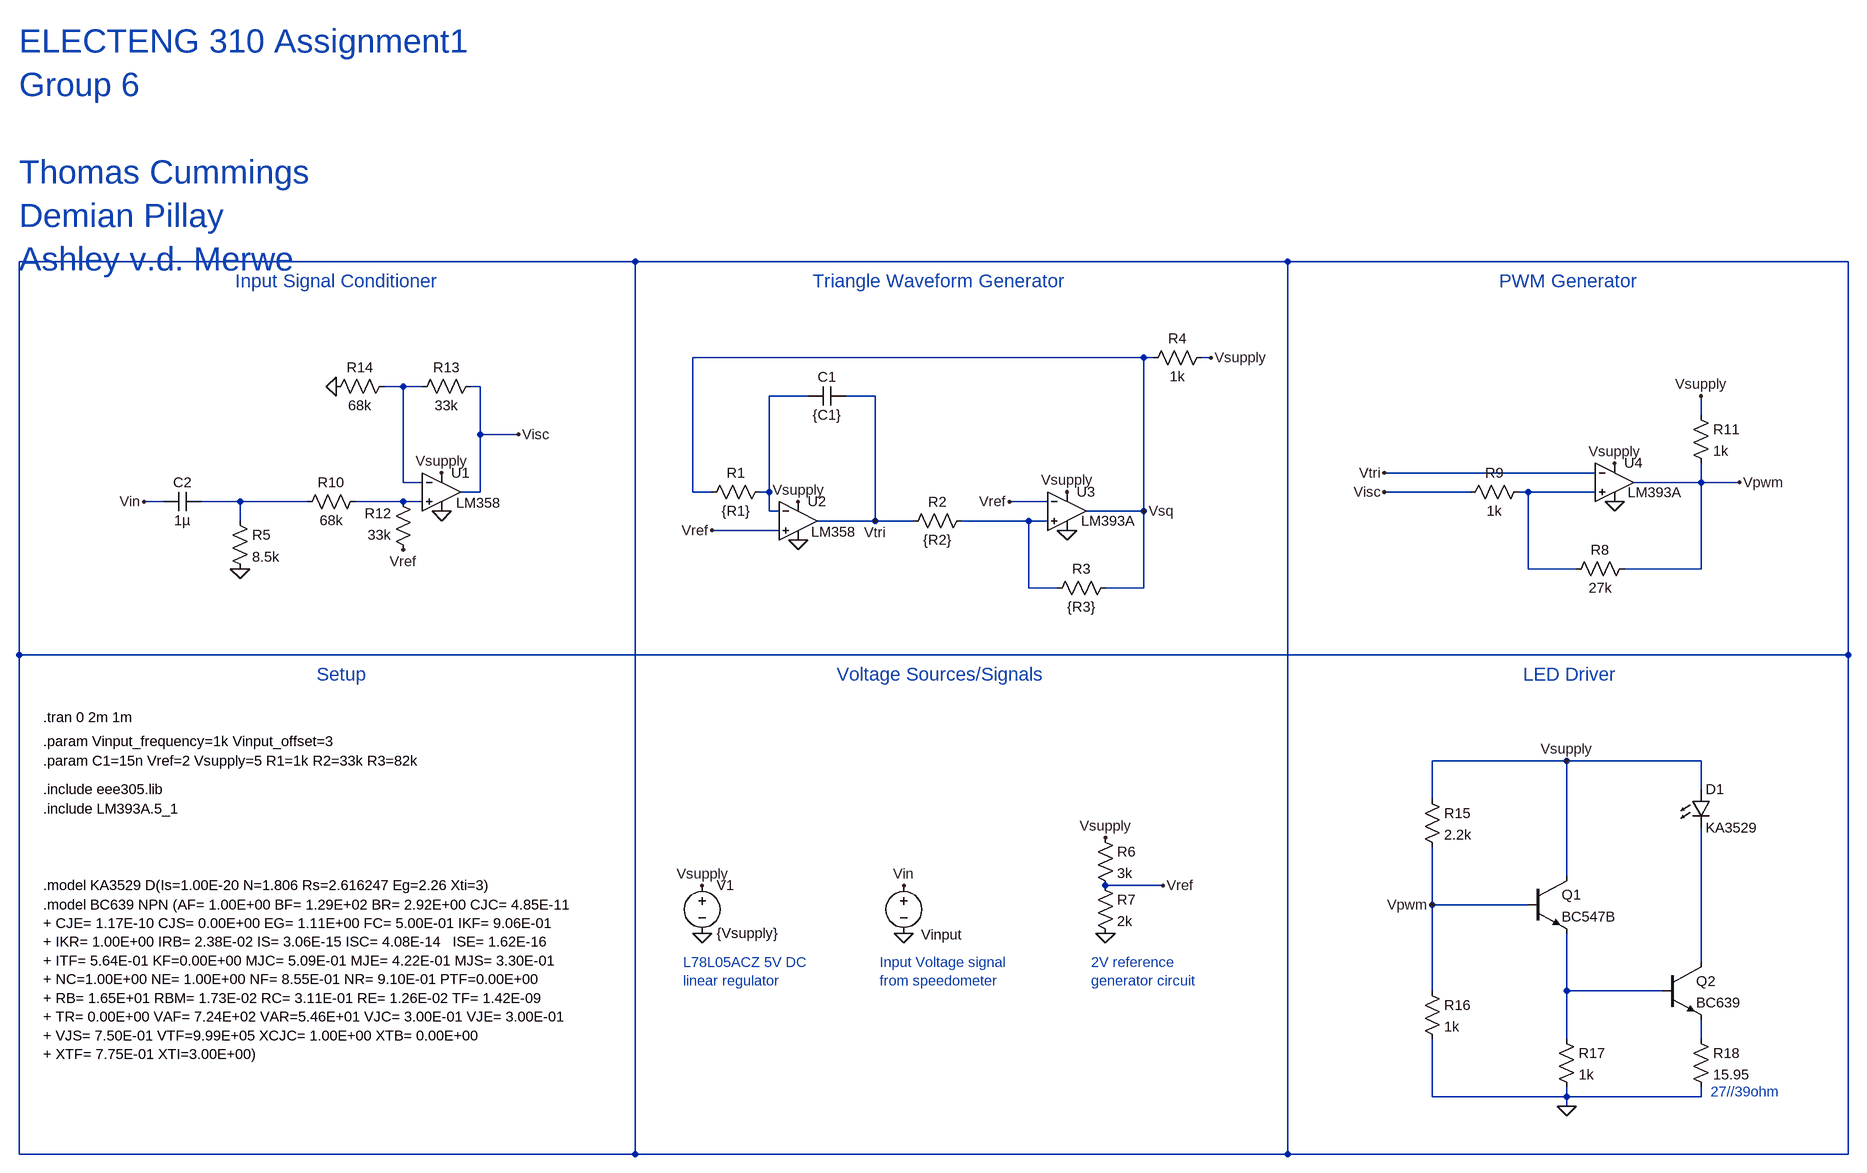
[diagram p0: schematic Assignment1_Task2_2_Practical.asc]
Assignment1_Task2_2_Practical.asc, the LTspice schematic file:
Version 4
SHEET 1 6052 1384
WIRE -336 -400 -1424 -400
WIRE 752 -400 -336 -400
WIRE 1856 -400 752 -400
WIRE 512 -240 -240 -240
WIRE 528 -240 512 -240
WIRE 624 -240 608 -240
WIRE -784 -192 -816 -192
WIRE -752 -192 -784 -192
WIRE -656 -192 -672 -192
WIRE -48 -176 -112 -176
WIRE 64 -176 16 -176
WIRE 1504 -144 1504 -176
WIRE -656 -112 -656 -192
WIRE -592 -112 -656 -112
WIRE 1328 -48 976 -48
WIRE -784 -32 -784 -192
WIRE -752 -32 -784 -32
WIRE 1504 -32 1504 -64
WIRE 1504 -32 1392 -32
WIRE 1568 -32 1504 -32
WIRE -656 -16 -656 -112
WIRE -656 -16 -688 -16
WIRE -240 -16 -240 -240
WIRE -208 -16 -240 -16
WIRE -112 -16 -112 -176
WIRE -112 -16 -128 -16
WIRE 1120 -16 976 -16
WIRE 1216 -16 1200 -16
WIRE 1328 -16 1216 -16
WIRE -1184 0 -1216 0
WIRE -1056 0 -1120 0
WIRE -944 0 -1056 0
WIRE -784 0 -864 0
WIRE -752 0 -784 0
WIRE 352 0 288 0
WIRE -112 16 -112 -16
WIRE -96 16 -112 16
WIRE 512 16 512 -240
WIRE 512 16 416 16
WIRE -1056 32 -1056 0
WIRE 64 32 64 -176
WIRE 64 32 -32 32
WIRE 128 32 64 32
WIRE 320 32 208 32
WIRE 352 32 320 32
WIRE -96 48 -208 48
WIRE 1216 112 1216 -16
WIRE 1296 112 1216 112
WIRE 1504 112 1504 -32
WIRE 1504 112 1376 112
WIRE 320 144 320 32
WIRE 368 144 320 144
WIRE 512 144 512 16
WIRE 512 144 448 144
WIRE -1424 256 -1424 -400
WIRE 1856 256 1856 -400
WIRE 1856 256 -1424 256
WIRE 1280 432 1056 432
WIRE 1504 432 1280 432
WIRE 1504 480 1504 432
WIRE 1056 496 1056 432
WIRE 1280 624 1280 432
WIRE 544 640 448 640
WIRE 1056 672 1056 576
WIRE 1216 672 1056 672
WIRE 1504 768 1504 544
WIRE 1056 816 1056 672
WIRE 1280 816 1280 720
WIRE 1440 816 1280 816
WIRE 1280 896 1280 816
WIRE 1504 896 1504 864
WIRE 1056 992 1056 896
WIRE 1280 992 1280 976
WIRE 1280 992 1056 992
WIRE 1504 992 1504 976
WIRE 1504 992 1280 992
WIRE 1280 1008 1280 992
WIRE -1424 1088 -1424 256
WIRE -336 1088 -336 -400
WIRE -336 1088 -1424 1088
WIRE 752 1088 752 -400
WIRE 752 1088 -336 1088
WIRE 1856 1088 1856 256
WIRE 1856 1088 752 1088
FLAG -224 720 0
FLAG -224 640 Vsupply
FLAG 64 32 Vtri
FLAG 384 48 0
FLAG -64 64 0
FLAG -208 48 Vref
FLAG 288 0 Vref
FLAG 512 16 Vsq
FLAG -64 0 Vsupply
FLAG 384 -16 Vsupply
FLAG 624 -240 Vsupply
FLAG 448 720 0
FLAG 448 560 Vsupply
FLAG -896 -192 0
FLAG -784 80 Vref
FLAG -720 16 0
FLAG 112 720 0
FLAG -720 -48 Vsupply
FLAG -1056 112 0
FLAG 1360 -64 Vsupply
FLAG 1360 0 0
FLAG -592 -112 Visc
FLAG 976 -48 Vtri
FLAG 1504 -176 Vsupply
FLAG 1568 -32 Vpwm
FLAG 1280 432 Vsupply
FLAG 1056 672 Vpwm
FLAG 1280 1008 0
FLAG -1216 0 Vin
FLAG 976 -16 Visc
FLAG 544 640 Vref
FLAG 112 640 Vin
SYMBOL voltage -224 624 R0
WINDOW 123 0 0 Left 0
WINDOW 39 0 0 Left 0
SYMATTR InstName V1
SYMATTR Value {Vsupply}
SYMBOL res -112 -32 R90
WINDOW 0 0 56 VBottom 2
WINDOW 3 32 56 VTop 2
SYMATTR InstName R1
SYMATTR Value {R1}
SYMBOL cap 16 -192 R90
WINDOW 0 0 32 VBottom 2
WINDOW 3 32 32 VTop 2
SYMATTR InstName C1
SYMATTR Value {C1}
SYMATTR SpiceLine Rser=10m
SYMBOL res 224 16 R90
WINDOW 0 0 56 VBottom 2
WINDOW 3 32 56 VTop 2
SYMATTR InstName R2
SYMATTR Value {R2}
SYMBOL res 464 128 R90
WINDOW 0 0 56 VBottom 2
WINDOW 3 32 56 VTop 2
SYMATTR InstName R3
SYMATTR Value {R3}
SYMBOL res 624 -256 R90
WINDOW 0 0 56 VBottom 2
WINDOW 3 32 56 VTop 2
SYMATTR InstName R4
SYMATTR Value 1k
SYMBOL res 432 544 R0
SYMATTR InstName R6
SYMATTR Value 3k
SYMBOL res 432 624 R0
SYMATTR InstName R7
SYMATTR Value 2k
SYMBOL res -848 -16 R90
WINDOW 0 0 56 VBottom 2
WINDOW 3 32 56 VTop 2
SYMATTR InstName R10
SYMATTR Value 68k
SYMBOL res -768 96 R180
WINDOW 0 36 76 Left 2
WINDOW 3 36 40 Left 2
SYMATTR InstName R12
SYMATTR Value 33k
SYMBOL res -768 -176 R270
WINDOW 0 32 56 VTop 2
WINDOW 3 0 56 VBottom 2
SYMATTR InstName R13
SYMATTR Value 33k
SYMBOL res -912 -176 R270
WINDOW 0 32 56 VTop 2
WINDOW 3 0 56 VBottom 2
SYMATTR InstName R14
SYMATTR Value 68k
SYMBOL voltage 112 624 R0
WINDOW 0 29 98 Left 2
WINDOW 3 -114 187 Invisible 2
WINDOW 123 0 0 Left 0
WINDOW 39 0 0 Left 0
SYMATTR InstName Vinput
SYMATTR Value SINE({Vinput_offset} 1 {Vinput_frequency})
SYMBOL cap -1120 -16 R90
WINDOW 0 0 32 VBottom 2
WINDOW 3 32 32 VTop 2
SYMATTR InstName C2
SYMATTR Value 1µ
SYMBOL res -1072 16 R0
SYMATTR InstName R5
SYMATTR Value 8.5k
SYMBOL res 1392 96 R90
WINDOW 0 0 56 VBottom 2
WINDOW 3 32 56 VTop 2
SYMATTR InstName R8
SYMATTR Value 27k
SYMBOL res 1216 -32 R90
WINDOW 0 0 56 VBottom 2
WINDOW 3 32 56 VTop 2
SYMATTR InstName R9
SYMATTR Value 1k
SYMBOL res 1488 -160 R0
SYMATTR InstName R11
SYMATTR Value 1k
SYMBOL OpAmps\\opamp2 -720 -80 R0
WINDOW 3 24 82 Left 2
SYMATTR Value LM358
SYMATTR InstName U1
SYMBOL OpAmps\\opamp2 -64 -32 R0
WINDOW 3 22 83 Left 2
SYMATTR Value LM358
SYMATTR InstName U2
SYMBOL OpAmps\\opamp2 384 -48 R0
WINDOW 3 24 80 Left 2
SYMATTR Value LM393A
SYMATTR InstName U3
SYMBOL OpAmps\\opamp2 1360 -96 R0
WINDOW 3 22 81 Left 2
SYMATTR Value LM393A
SYMATTR InstName U4
SYMBOL npn 1216 624 R0
SYMATTR InstName Q1
SYMATTR Value BC547B
SYMBOL res 1040 480 R0
SYMATTR InstName R15
SYMATTR Value 2.2k
SYMBOL res 1040 800 R0
SYMATTR InstName R16
SYMATTR Value 1k
SYMBOL res 1264 880 R0
SYMATTR InstName R17
SYMATTR Value 1k
SYMBOL res 1488 880 R0
SYMATTR InstName R18
SYMATTR Value 15.95
SYMBOL LED 1488 480 R0
SYMATTR InstName D1
SYMATTR Value KA3529
SYMBOL npn 1440 768 R0
SYMATTR InstName Q2
SYMATTR Value BC639
TEXT -1384 432 Left 2 !.param C1=15n Vref=2 Vsupply=5 R1=1k R2=33k R3=82k
TEXT -1384 512 Left 2 !.include LM393A.5_1
TEXT -1384 400 Left 2 !.param Vinput_frequency=1k Vinput_offset=3
TEXT -1384 360 Left 2 !.tran 0 2m 1m
TEXT -1384 480 Left 2 !.include eee305.lib
TEXT -1384 640 Left 2 !.model KA3529 D(Is=1.00E-20 N=1.806 Rs=2.616247 Eg=2.26 Xti=3)
TEXT 1520 984 Left 2 ;27//39ohm
TEXT -40 -368 Left 3 ;Triangle Waveform Generator
TEXT -1064 -368 Left 3 ;Input Signal Conditioner
TEXT 1208 288 Left 3 ;LED Driver
TEXT 1168 -368 Left 3 ;PWM Generator
TEXT -1384 672 Left 2 !.model BC639 NPN (AF= 1.00E+00 BF= 1.29E+02 BR= 2.92E+00 CJC= 4.85E-11 \n+ CJE= 1.17E-10 CJS= 0.00E+00 EG= 1.11E+00 FC= 5.00E-01 IKF= 9.06E-01 \n+ IKR= 1.00E+00 IRB= 2.38E-02 IS= 3.06E-15 ISC= 4.08E-14   ISE= 1.62E-16 \n+ ITF= 5.64E-01 KF=0.00E+00 MJC= 5.09E-01 MJE= 4.22E-01 MJS= 3.30E-01 \n+ NC=1.00E+00 NE= 1.00E+00 NF= 8.55E-01 NR= 9.10E-01 PTF=0.00E+00 \n+ RB= 1.65E+01 RBM= 1.73E-02 RC= 3.11E-01 RE= 1.26E-02 TF= 1.42E-09  \n+ TR= 0.00E+00 VAF= 7.24E+02 VAR=5.46E+01 VJC= 3.00E-01 VJE= 3.00E-01 \n+ VJS= 7.50E-01 VTF=9.99E+05 XCJC= 1.00E+00 XTB= 0.00E+00 \n+ XTF= 7.75E-01 XTI=3.00E+00)
TEXT -256 768 Left 2 ;L78L05ACZ 5V DC\nlinear regulator
TEXT -928 288 Left 3 ;Setup
TEXT 72 768 Left 2 ;Input Voltage signal\nfrom speedometer
TEXT 424 768 Left 2 ;2V reference \ngenerator circuit
TEXT 0 288 Left 3 ;Voltage Sources/Signals
TEXT -1424 -768 Left 5 ;ELECTENG 310 Assignment1\nGroup 6\n \nThomas Cummings\nDemian Pillay\nAshley v.d. Merwe

The netlist it stands for:
* Assignment1_Task2_2_Practical.asc
V1 Vsupply 0 {Vsupply}
R1 N003 Vsq {R1}
C1 Vtri N003 {C1} Rser=10m
R2 N007 Vtri {R2}
R3 Vsq N007 {R3}
R4 Vsupply Vsq 1k
R6 Vsupply Vref 3k
R7 Vref 0 2k
R10 N006 N005 68k
R12 Vref N006 33k
R13 N002 Visc 33k
R14 0 N002 68k
Vinput Vin 0 SINE({Vinput_offset} 1 {Vinput_frequency})
C2 N005 Vin 1µ
R5 N005 0 8.5k
R8 Vpwm N004 27k
R9 N004 Visc 1k
R11 Vsupply Vpwm 1k
XU1 N006 N002 Vsupply 0 Visc LM358  ; pins In+ In- V+ V- OUT
XU2 Vref N003 Vsupply 0 Vtri LM358  ; pins In+ In- V+ V- OUT
XU3 N007 Vref Vsupply 0 Vsq LM393A  ; pins In+ In- V+ V- OUT
XU4 N004 Vtri Vsupply 0 Vpwm LM393A  ; pins In+ In- V+ V- OUT
Q1 Vsupply Vpwm N009 0 BC547B
R15 Vsupply Vpwm 2.2k
R16 Vpwm 0 1k
R17 N009 0 1k
R18 N010 0 15.95
D1 Vsupply N008 KA3529
Q2 N008 N009 N010 0 BC639
.model D D
.lib standard.dio
.model NPN NPN
.model PNP PNP
.lib standard.bjt
.param C1=15n Vref=2 Vsupply=5 R1=1k R2=33k R3=82k
.include LM393A.5_1
.param Vinput_frequency=1k Vinput_offset=3
.tran 0 2m 1m
.include eee305.lib
.model KA3529 D(Is=1.00E-20 N=1.806 Rs=2.616247 Eg=2.26 Xti=3)
* 27//39ohm
* Triangle Waveform Generator
* Input Signal Conditioner
* LED Driver
* PWM Generator
.model BC639 NPN (AF= 1.00E+00 BF= 1.29E+02 BR= 2.92E+00 CJC= 4.85E-11
+ CJE= 1.17E-10 CJS= 0.00E+00 EG= 1.11E+00 FC= 5.00E-01 IKF= 9.06E-01
+ IKR= 1.00E+00 IRB= 2.38E-02 IS= 3.06E-15 ISC= 4.08E-14   ISE= 1.62E-16
+ ITF= 5.64E-01 KF=0.00E+00 MJC= 5.09E-01 MJE= 4.22E-01 MJS= 3.30E-01
+ NC=1.00E+00 NE= 1.00E+00 NF= 8.55E-01 NR= 9.10E-01 PTF=0.00E+00
+ RB= 1.65E+01 RBM= 1.73E-02 RC= 3.11E-01 RE= 1.26E-02 TF= 1.42E-09
+ TR= 0.00E+00 VAF= 7.24E+02 VAR=5.46E+01 VJC= 3.00E-01 VJE= 3.00E-01
+ VJS= 7.50E-01 VTF=9.99E+05 XCJC= 1.00E+00 XTB= 0.00E+00
+ XTF= 7.75E-01 XTI=3.00E+00)
* L78L05ACZ 5V DC
* linear regulator
* Setup
* Input Voltage signal
* from speedometer
* 2V reference
* generator circuit
* Voltage Sources/Signals
* ELECTENG 310 Assignment1
* Group 6
* Thomas Cummings
* Demian Pillay
* Ashley v.d. Merwe
.backanno
.end